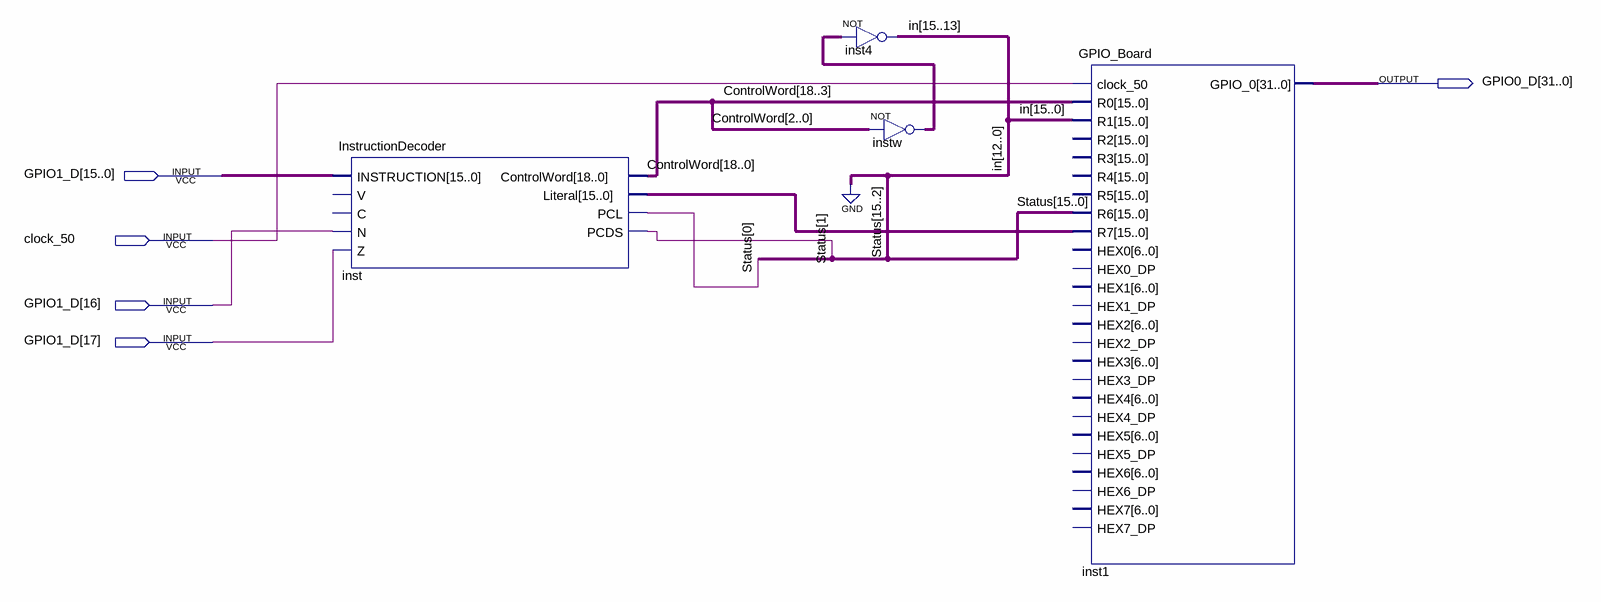
[diagram p0: schematic sheet]
// Quartus schematic InstructTest.bdf as structural Verilog: 4 symbols, 5 pins
module InstructTest (
  input  [17:0] GPIO1_D,
  input  clock_50,
  output [31:0] GPIO0_D
);

  wire [1:0] Status;
  wire [2:0] instw_out;
  wire [15:0] in, inst_literal;
  wire [18:0] ControlWord;

  InstructionDecoder inst (
    .INSTRUCTION(GPIO1_D[15:0]), .N(GPIO1_D[16]), .Z(GPIO1_D[17]), .ControlWord(ControlWord),
    .Literal(inst_literal), .PCL(Status[0]), .PCDS(Status[1]));  // open: V, C
  assign in[15:13] = ~instw_out;  // NOT inst4, 3 bits wide
  assign instw_out = ~ControlWord[2:0];  // NOT instw, 3 bits wide
  GPIO_Board inst1 (
    .clock_50(clock_50), .R0(ControlWord[18:3]), .R1(in), .R6({{14{1'b0}}, Status}), .R7(inst_literal),
    .GPIO_0(GPIO0_D));  // open: R2, R3, R4, R5, HEX0, HEX0_DP, HEX1, HEX1_DP, HEX2, HEX2_DP, HEX3, HEX3_DP, HEX4, HEX4_DP, HEX5, HEX5_DP, HEX6, HEX6_DP, HEX7, HEX7_DP
endmodule
